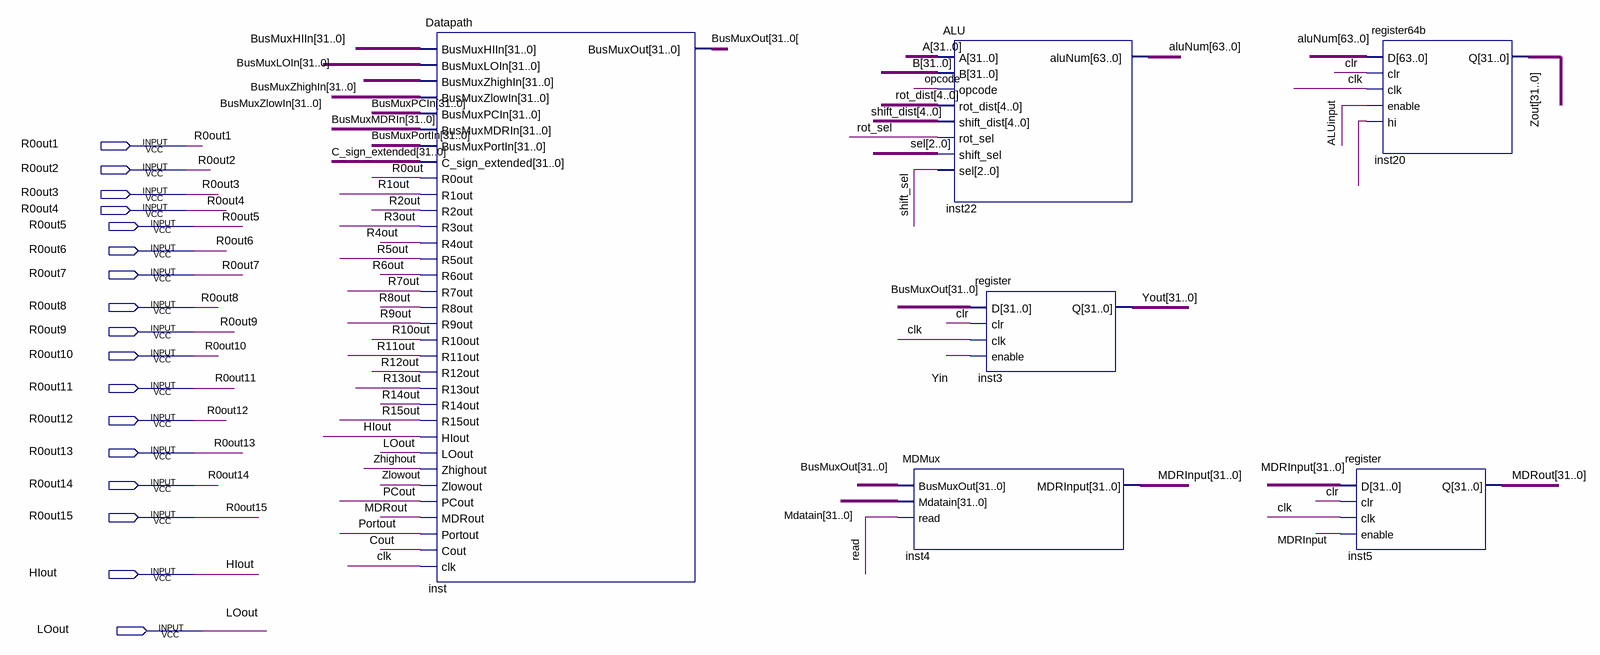
[diagram p0: schematic sheet]
// Quartus schematic CpuDesign.bdf as structural Verilog: 6 symbols, 17 pins
module CpuDesign (
  input  R0out1,
  input  R0out2,
  input  R0out3,
  input  R0out4,
  input  R0out5,
  input  R0out6,
  input  R0out7,
  input  R0out8,
  input  R0out9,
  input  R0out10,
  input  R0out11,
  input  R0out12,
  input  R0out13,
  input  R0out14,
  input  R0out15,
  input  HIout,
  input  LOout
);

  wire ALUinput, \BusMuxOut[31..0[ , clk, clr, Cout, MDRInput_1bit, MDRout_1bit, opcode, PCout, Portout,
       R0out, R1out, R2out, R3out, R4out, R5out, R6out, R7out, R8out, R9out, R10out, R11out, R12out, R13out,
       R14out, R15out, read, rot_sel, shift_sel, undriven, Yin, Zhighout, Zlowout;
  wire [2:0] sel;
  wire [4:0] rot_dist, shift_dist;
  wire [31:0] A, B, BusMuxHIIn, BusMuxLOIn, BusMuxMDRIn, BusMuxOut, BusMuxPCIn, BusMuxPortIn, BusMuxZhighIn,
       BusMuxZlowIn, C_sign_extended, Mdatain, MDRInput, MDRout, Yout, Zout;
  wire [63:0] aluNum;

  Datapath inst (
    .BusMuxHIIn(BusMuxHIIn), .BusMuxLOIn(BusMuxLOIn), .BusMuxZhighIn(BusMuxZhighIn),
    .BusMuxZlowIn(BusMuxZlowIn), .BusMuxPCIn(BusMuxPCIn), .BusMuxMDRIn(BusMuxMDRIn),
    .BusMuxPortIn(BusMuxPortIn), .C_sign_extended(C_sign_extended), .R0out(R0out), .R1out(R1out),
    .R2out(R2out), .R3out(R3out), .R4out(R4out), .R5out(R5out), .R6out(R6out), .R7out(R7out), .R8out(R8out),
    .R9out(R9out), .R10out(R10out), .R11out(R11out), .R12out(R12out), .R13out(R13out), .R14out(R14out),
    .R15out(R15out), .HIout(HIout), .LOout(LOout), .Zhighout(Zhighout), .Zlowout(Zlowout), .PCout(PCout),
    .MDRout(MDRout_1bit), .Portout(Portout), .Cout(Cout), .clk(clk), .BusMuxOut(\BusMuxOut[31..0[ ));
  MDMux inst4 (.BusMuxOut(BusMuxOut), .Mdatain(Mdatain), .read(read), .MDRInput(MDRInput));
  ALU inst22 (
    .A(A), .B(B), .opcode(opcode), .rot_dist(rot_dist), .shift_dist(shift_dist), .rot_sel(rot_sel),
    .shift_sel(sel), .sel({3{shift_sel}}), .aluNum(aluNum));
  register inst3 (.D(BusMuxOut), .clr(clr), .clk(clk), .enable(Yin), .Q(Yout));
  register inst5 (.D(MDRInput), .clr(clr), .clk(clk), .enable(MDRInput_1bit), .Q(MDRout));
  register64b inst20 (.D(aluNum), .clr(clr), .clk(clk), .enable(ALUinput), .hi(undriven), .Q(Zout));
endmodule
